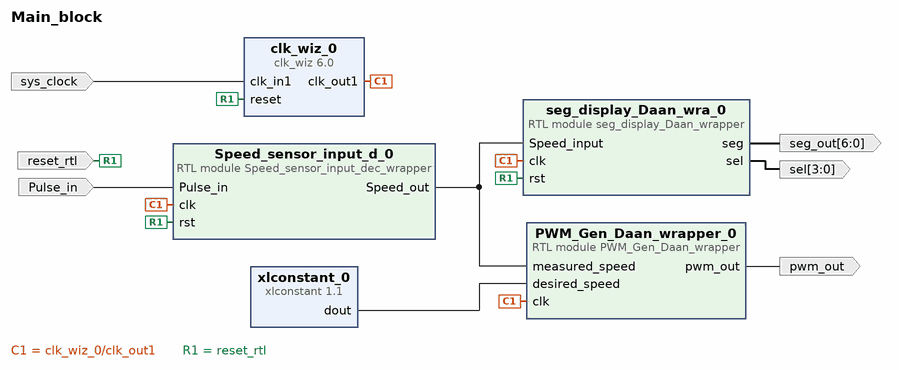
[diagram p0: block diagram of the top level]
# Vivado block design Main_block, xc7z020clg400-1, Vivado 2023.1
create_bd_design Main_block

create_bd_port -dir I Pulse_in
create_bd_port -dir I -type clk sys_clock
set_property -dict {CONFIG.FREQ_HZ 125000000 CONFIG.PHASE 0.0} [get_bd_ports sys_clock]
create_bd_port -dir I -type rst reset_rtl
set_property -dict {CONFIG.POLARITY ACTIVE_HIGH} [get_bd_ports reset_rtl]
create_bd_port -dir O -from 6 -to 0 seg_out
create_bd_port -dir O -from 3 -to 0 sel
create_bd_port -dir O pwm_out

create_bd_cell -type ip -vlnv xilinx.com:ip:xlconstant:1.1 xlconstant_0
create_bd_cell -type ip -vlnv xilinx.com:ip:clk_wiz:6.0 clk_wiz_0
set_property -dict [list \
  CONFIG.CLKOUT1_JITTER 124.615 \
  CONFIG.CLKOUT1_REQUESTED_OUT_FREQ 100.000 \
  CONFIG.CLK_IN1_BOARD_INTERFACE sys_clock \
  CONFIG.MMCM_CLKOUT0_DIVIDE_F 10.000 \
  CONFIG.USE_BOARD_FLOW true \
] [get_bd_cells clk_wiz_0]
create_bd_cell -type module -reference seg_display_Daan_wrapper seg_display_Daan_wra_0
create_bd_cell -type module -reference PWM_Gen_Daan_wrapper PWM_Gen_Daan_wrapper_0
create_bd_cell -type module -reference Speed_sensor_input_dec_wrapper Speed_sensor_input_d_0

# ---- connections ----

connect_bd_net [get_bd_pins PWM_Gen_Daan_wrapper_0/pwm_out] [get_bd_ports pwm_out]
connect_bd_net [get_bd_ports Pulse_in] [get_bd_pins Speed_sensor_input_d_0/Pulse_in]
connect_bd_net [get_bd_pins Speed_sensor_input_d_0/Speed_out] \
  [get_bd_pins PWM_Gen_Daan_wrapper_0/measured_speed] [get_bd_pins seg_display_Daan_wra_0/Speed_input]
connect_bd_net [get_bd_pins clk_wiz_0/clk_out1] \
  [get_bd_pins PWM_Gen_Daan_wrapper_0/clk] [get_bd_pins seg_display_Daan_wra_0/clk] [get_bd_pins Speed_sensor_input_d_0/clk]
connect_bd_net [get_bd_ports reset_rtl] \
  [get_bd_pins clk_wiz_0/reset] [get_bd_pins Speed_sensor_input_d_0/rst] [get_bd_pins seg_display_Daan_wra_0/rst]
connect_bd_net [get_bd_pins seg_display_Daan_wra_0/seg] [get_bd_ports seg_out]
connect_bd_net [get_bd_pins seg_display_Daan_wra_0/sel] [get_bd_ports sel]
connect_bd_net [get_bd_ports sys_clock] [get_bd_pins clk_wiz_0/clk_in1]
connect_bd_net [get_bd_pins xlconstant_0/dout] [get_bd_pins PWM_Gen_Daan_wrapper_0/desired_speed]

validate_bd_design
save_bd_design
